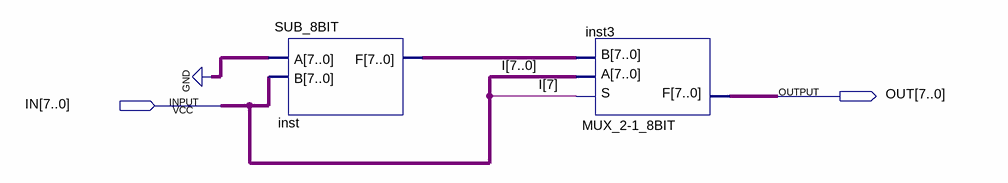
[diagram p0: schematic sheet]
// Quartus schematic ABS_8BIT.bdf as structural Verilog: 2 symbols, 2 pins
module ABS_8BIT (
  input  [7:0] IN,
  output [7:0] OUT
);

  wire [7:0] inst_f;

  SUB_8BIT inst (.A({8{1'b0}}), .B(IN), .F(inst_f));
  \MUX_2-1_8BIT  inst3 (.S(IN[7]), .A(IN), .B(inst_f), .F(OUT));

  // Other names for the same wires on the sheet: I[7:0] = IN
endmodule
